# Altium schematic sheet SLAVE_HW.SchDoc
size A4; DocumentNumber: 1; SheetNumber: 1; SheetTotal: 5
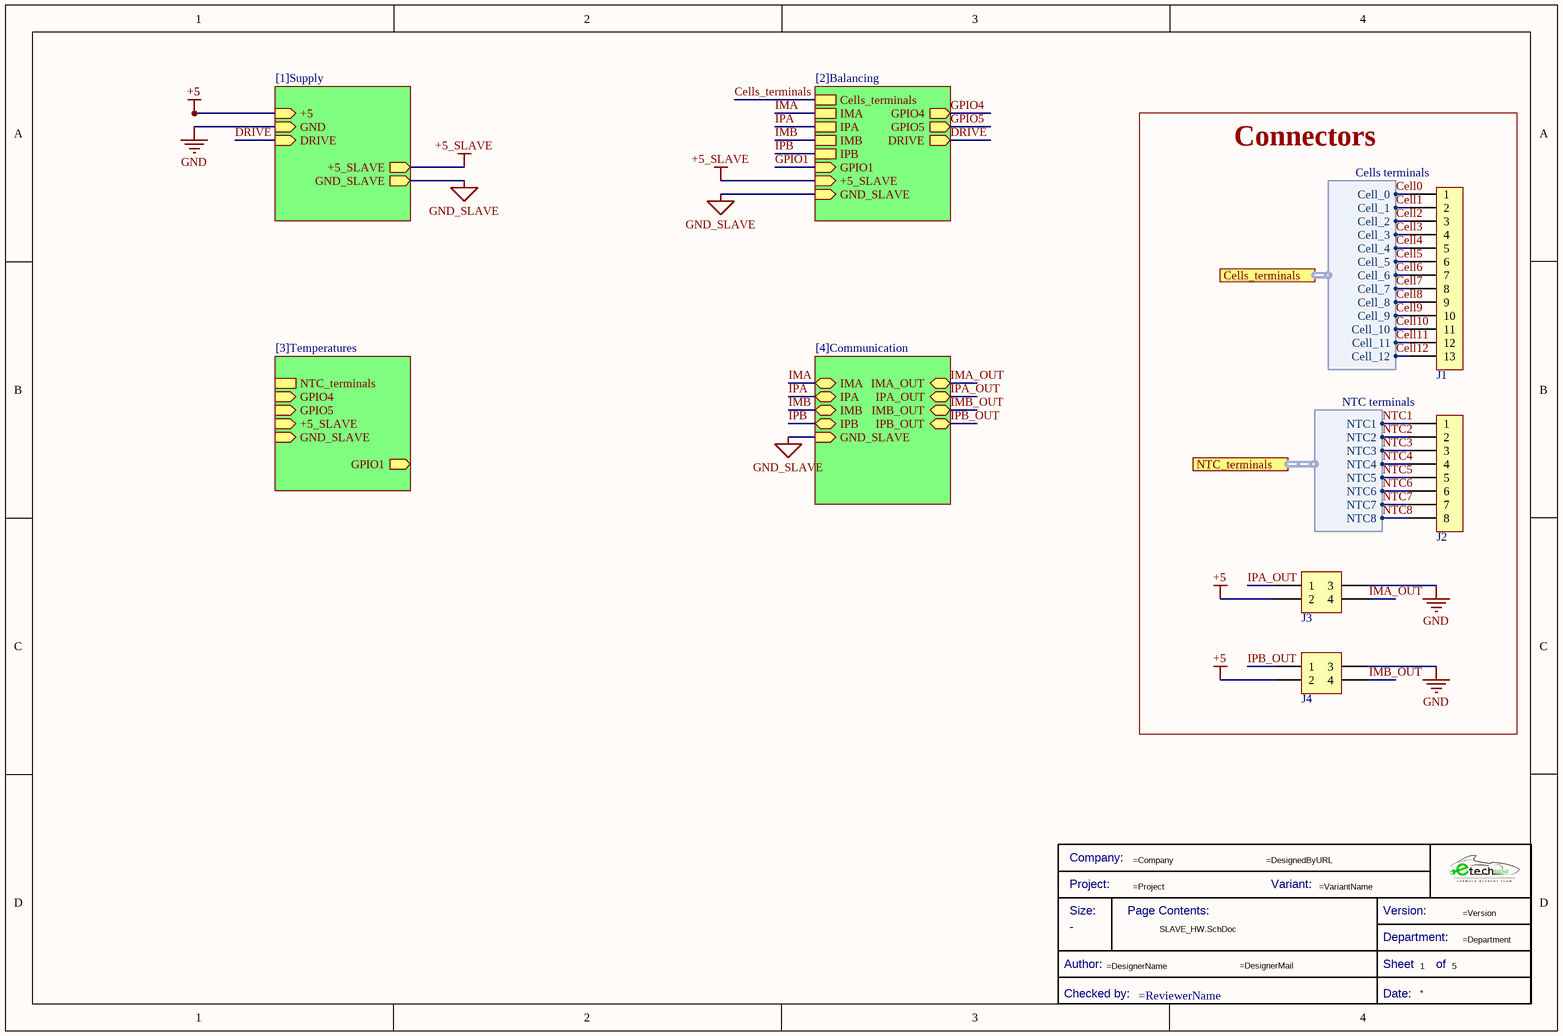
[diagram p0: SLAVE_HW.SchDoc]

## Parts
*  Title Block_template  (value not drawn)  (graphical)
J1  61301211121  [J_Pinheader_1x13]  (value not drawn)
J2  61301211121  [J_Pinheader_1x8]  (value not drawn)
J3  J_NanoFit_2x2  [J_NanoFit_2x2_v]  (value not drawn)
J4  J_NanoFit_2x2  [J_NanoFit_2x2_v]  (value not drawn)

## Blocks framed on the sheet
Connectors: J1-J4

## Sub-sheets
Balancing = [2]Balancing: Cells_terminals (harness Cells terminals), DRIVE (out), IMA, IPA, IMB, IPB, GPIO4 (out), GPIO5 (out), GPIO1 (in), +5_SLAVE (in), GND_SLAVE (in)
Communication = [4]Communication: IMA_OUT (bidir), IPA_OUT (bidir), IMB_OUT (bidir), IPB_OUT (bidir), IMA (bidir), IPA (bidir), IMB (bidir), IPB (bidir), GND_SLAVE (in)
Supply = [1]Supply: +5 (in), GND (in), +5_SLAVE (out), GND_SLAVE (out), DRIVE (in)
Temperatures = [3]Temperatures: NTC_terminals (harness NTC terminals), GPIO4 (in), GPIO5 (in), +5_SLAVE (in), GND_SLAVE (in), GPIO1 (out)

## Ports
Cells_terminals (harness Cells terminals), NTC_terminals (harness NTC terminals)

## Harnesses
Cells terminals: Cell_0, Cell_1, Cell_2, Cell_3, Cell_4, Cell_5, Cell_6, Cell_7, Cell_8, Cell_9, Cell_10, Cell_11, Cell_12
NTC terminals: NTC1, NTC2, NTC3, NTC4, NTC5, NTC6, NTC7, NTC8

## Nets
+5: J3.2 J4.2 ; sheet Supply/+5
+5_SLAVE: sheet Supply/+5_SLAVE, sheet Balancing/+5_SLAVE
GND: J3.3 J4.3 ; sheet Supply/GND
GND_SLAVE: sheet Supply/GND_SLAVE, sheet Balancing/GND_SLAVE, sheet Communication/GND_SLAVE
Cell0: J1.1 ; port Cells_terminals.Cell_0
Cell1: J1.2 ; port Cells_terminals.Cell_1
Cell2: J1.3 ; port Cells_terminals.Cell_2
Cell3: J1.4 ; port Cells_terminals.Cell_3
Cell4: J1.5 ; port Cells_terminals.Cell_4
Cell5: J1.6 ; port Cells_terminals.Cell_5
Cell6: J1.7 ; port Cells_terminals.Cell_6
Cell7: J1.8 ; port Cells_terminals.Cell_7
Cell8: J1.9 ; port Cells_terminals.Cell_8
Cell9: J1.10 ; port Cells_terminals.Cell_9
Cell10: J1.11 ; port Cells_terminals.Cell_10
Cell11: J1.12 ; port Cells_terminals.Cell_11
Cell12: J1.13 ; port Cells_terminals.Cell_12
DRIVE: sheet Supply/DRIVE, sheet Balancing/DRIVE
GPIO1: sheet Balancing/GPIO1
GPIO4: sheet Balancing/GPIO4
GPIO5: sheet Balancing/GPIO5
IMA: sheet Balancing/IMA, sheet Communication/IMA
IMA_OUT: J3.4 ; sheet Communication/IMA_OUT
IMB: sheet Balancing/IMB, sheet Communication/IMB
IMB_OUT: J4.4 ; sheet Communication/IMB_OUT
IPA: sheet Balancing/IPA, sheet Communication/IPA
IPA_OUT: J3.1 ; sheet Communication/IPA_OUT
IPB: sheet Balancing/IPB, sheet Communication/IPB
IPB_OUT: J4.1 ; sheet Communication/IPB_OUT
NTC1: J2.1 ; port NTC_terminals.NTC1
NTC2: J2.2 ; port NTC_terminals.NTC2
NTC3: J2.3 ; port NTC_terminals.NTC3
NTC4: J2.4 ; port NTC_terminals.NTC4
NTC5: J2.5 ; port NTC_terminals.NTC5
NTC6: J2.6 ; port NTC_terminals.NTC6
NTC7: J2.7 ; port NTC_terminals.NTC7
NTC8: J2.8 ; port NTC_terminals.NTC8

## Notes on the sheet
- (in symbol Title Block_template) Company:; Project:; Variant:; Size:; Page Contents:; Version:; Department:; Author:; Sheet; of; Checked by:; Date:

## Library data of the parts
* = Title Block_template: Standard Title Block; .Creator: GP; Category: Title Block; .PCBcheck: GP; .SCHcheck: GP; Checked by:: =ReviewerName; Size: -
J1 = J_Pinheader_1x13: THT Vertical Pin Header WR-PHD, Pitch 2.54 mm, Single Row, 13 pins; Manufacturer 1: Wurth Electronics; Number of Positions: 12; Gender: Male; Connector Type: Male Pin; Pitch: 0.1inch; Supplier 1: Digi-Key; Manufacturer Part Number 1: 61301211121; RoHS: Yes; Category: Connectors; Stock 1: 2124; Pricing 1: 1=0,57000, 10=0,48400, 25=0,40400, 50=0,33700, 100=0,30600, 1000=0,27800 (USD); Mount: Through Hole; Contact Plating: Gold; Contact Material: Copper; Color: Black; Number of Rows: 1; Packaging: Bulk; Termination: Solder; Number of Contacts: 12; Contact Mating Length: 0.236inch; REACH SVHC: Unknown; RoHS Compliant: Yes; ComponentLink1URL: http://www.farnell.com/cad/1737268.pdf?src-supplier=Element14; ComponentLink1Description: http://www.farnell.com/cad/1737268.pdf?src-supplier=Element14; ComponentLink2URL: https://katalog.we-online.de/em/datasheet/6130xx11121.pdf?src-supplier=Digi-Key; ComponentLink2Description: https://katalog.we-online.de/em/datasheet/6130xx11121.pdf?src-supplier=Digi-Key
J2 = J_Pinheader_1x8: THT Vertical Pin Header WR-PHD, Pitch 2.54 mm, Single Row, 12 pins; Manufacturer 1: Wurth Electronics; Number of Positions: 12; Gender: Male; Connector Type: Male Pin; Pitch: 0.1inch; Supplier 1: Digi-Key; Manufacturer Part Number 1: 61301211121; RoHS: Yes; Category: Connectors; Stock 1: 2124; Pricing 1: 1=0,57000, 10=0,48400, 25=0,40400, 50=0,33700, 100=0,30600, 1000=0,27800 (USD); Mount: Through Hole; Contact Plating: Gold; Contact Material: Copper; Color: Black; Number of Rows: 1; Packaging: Bulk; Termination: Solder; Number of Contacts: 12; Contact Mating Length: 0.236inch; REACH SVHC: Unknown; RoHS Compliant: Yes; ComponentLink1URL: http://www.farnell.com/cad/1737268.pdf?src-supplier=Element14; ComponentLink1Description: http://www.farnell.com/cad/1737268.pdf?src-supplier=Element14; ComponentLink2URL: https://katalog.we-online.de/em/datasheet/6130xx11121.pdf?src-supplier=Digi-Key; ComponentLink2Description: https://katalog.we-online.de/em/datasheet/6130xx11121.pdf?src-supplier=Digi-Key
J3 J4 = J_NanoFit_2x2: Conn Nano-Fit Power HDR 4 POS 2.5mm Solder ST Through Hole 4 Terminal Single Port Tray; Manufacturer 1: Molex; Manufacturer Part Number 1: 1053101104; Supplier 1: Farnell; RoHS: Yes; Category: Uncategorized; Stock 1: 255; Pricing 1: 1=1,43000, 10=1,18000, 50=0,74900, 100=0,72900, 500=0,71400, 1000=0,70700 (EUR); ComponentLink1URL: https://www.molex.com/pdm_docs/ps/PS-105300-100-001.pdf?src-supplier=Digi-Key; ComponentLink1Description: https://www.molex.com/pdm_docs/ps/PS-105300-100-001.pdf?src-supplier=Digi-Key; Supplier Part Number 1: 2820681